# Altium schematic sheet ethernet.SchDoc: Ethernet interface
size A3; Hw_rev: 0; License: GPLv3; Address3: Firenze; Address4: ITALY; DocumentNumber: 6; Revision: 0; SheetNumber: 6; SheetTotal: 8
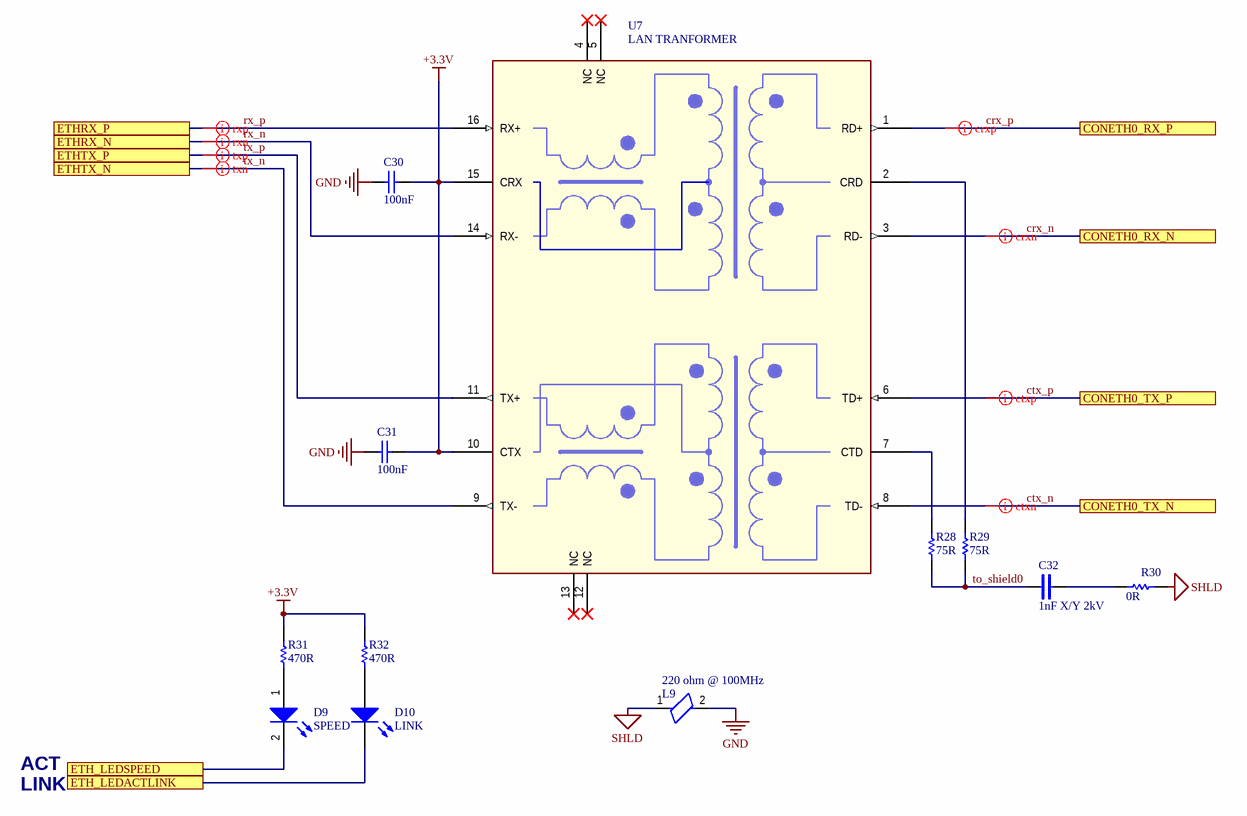
[diagram p0: ethernet.SchDoc]

## Parts
C30  100nF  [0603_[1608]]
C31  100nF  [0603_[1608]]
C32  1nF X/Y 2kV  [1808_[4520]]
D9  SPEED  [0603_[1608]_K2-A1_LED]
D10  LINK  [0603_[1608]_K2-A1_LED]
L9  220 ohm @ 100MHz  [0805_[2012]]
R28  75R  [0603_[1608]]
R29  75R  [0603_[1608]]
R30  0R  [0603_[1608]]
R31  470R  [0603_[1608]]
R32  470R  [0603_[1608]]
U7  LAN TRANFORMER  [LAN_TR_1.27MM_SMD]

## Ports
CONETH0_RX_N, CONETH0_RX_P, CONETH0_TX_N, CONETH0_TX_P, ETH_LEDACTLINK, ETH_LEDSPEED, ETHRX_N, ETHRX_P, ETHTX_N, ETHTX_P

## Nets
+3.3V: C30.2 C31.2 R31.2 R32.2 U7.10(CTX) U7.15(CRX)
GND: C30.1 C31.1 L9.2
SHLD: L9.1 R30.1
crx_n: U7.3(RD-) ; port CONETH0_RX_N
crx_p: U7.1(RD+) ; port CONETH0_RX_P
ctx_n: U7.8(TD-) ; port CONETH0_TX_N
ctx_p: U7.6(TD+) ; port CONETH0_TX_P
ETH_LEDACTLINK: D10.2(K) ; port ETH_LEDACTLINK
ETH_LEDSPEED: D9.2(K) ; port ETH_LEDSPEED
rx_n: U7.14(RX-) ; port ETHRX_N
rx_p: U7.16(RX+) ; port ETHRX_P
to_shield0: C32.1 R28.1 R29.1
tx_n: U7.9(TX-) ; port ETHTX_N
tx_p: U7.11(TX+) ; port ETHTX_P
NetC32_2: C32.2 R30.2
NetD9_1: D9.1(A) R31.1
NetD10_1: D10.1(A) R32.1
NetR28_2: R28.2 U7.7(CTD)
NetR29_2: R29.2 U7.2(CRD)

Not connected (* = marked no-connect by the designer): U7 4(NC)* 5(NC)* 12(NC)* 13(NC)*

## Layout directives
differential pair: crx_n, crx_p, ctx_n, ctx_p, rx_n, rx_p, tx_n, tx_p

## Notes on the sheet
- ACT
- LINK

## Library data of the parts
C30 C31 = Cap: Ceramic X7R 50V; Value: 100pF; Published: 8-Jun-2000; LatestRevisionDate: 17-Jul-2002; LatestRevisionNote: Re-released for DXP Platform.; PackageReference: RAD-0.3; Publisher: Altium Limited; PackageDescription: Radial Cap, Thru-Hole; 2 Leads; 0.3 in Pin Spacing
C32 = cap_xy: CER 250VAC X7R X1/Y1 (GA342DR7GF102KW)
D9 D10 = LED0: LED Green; Published: 8-Jun-2000; LatestRevisionDate: 08-Jul-2005; LatestRevisionNote: Mech Layer 1 removed.; PackageReference: LED-0; Publisher: Altium Limited; PackageDescription: LED; 2 Leads
L9 = BEAD_ FERRITE: WE 742792022
R28 R29 = Res1: Resistor; Revision: July-2002: Re-released for DXP Platform.
R30 = Res1: Resistor; Value: 0; Published: 8-Jun-2000; LatestRevisionDate: 17-Jul-2002; LatestRevisionNote: Re-released for DXP Platform.; PackageReference: AXIAL-0.3; Publisher: Altium Limited; PackageDescription: Axial Device, Thru-Hole; 2 Leads; 0.3 in Pin Spacing
R31 R32 = Res1: Resistor; Value: 1K; Published: 8-Jun-2000; Revision: July-2002: Re-released for DXP Platform.; Publisher: Altium Limited
U7 = LAN-TR-WE7490100111A: Lan transformer (WE 7490100111A (side A); WE 7490100161A (side B))